# Altium schematic sheet Option_AP6xxx.SchDoc
size 297 x 209 mm
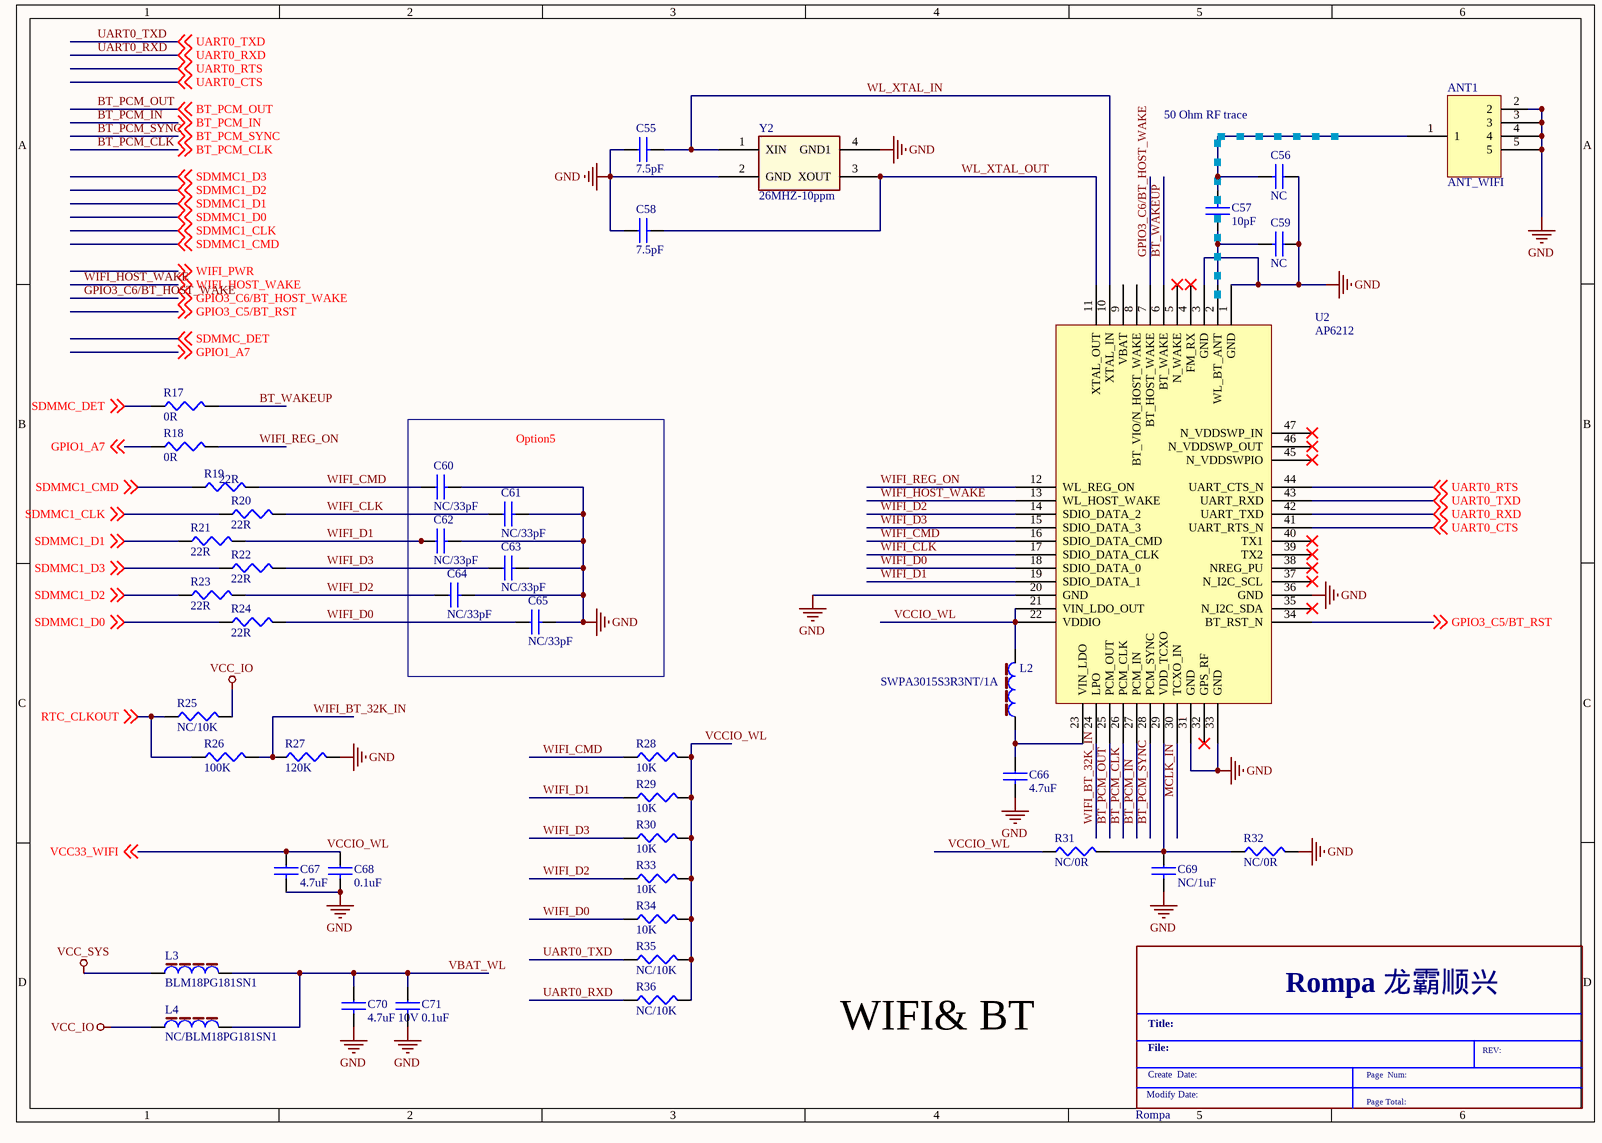
[diagram p0: Option_AP6xxx.SchDoc]

## Parts
*  Rompa  (graphical)
ANT1  ANT_WIFI
C55  7.5pF  [C0402]
C56  NC  [C0402]
C57  10pF  [C0402]
C58  7.5pF  [C0402]
C59  NC  [C0402]
C60  NC/33pF  [C0402]
C61  NC/33pF  [C0402]
C62  NC/33pF  [C0402]
C63  NC/33pF  [C0402]
C64  NC/33pF  [C0402]
C65  NC/33pF  [C0402]
C66  4.7uF  [C0603]
C67  4.7uF  [C0603]
C68  0.1uF  [C0402]
C69  NC/1uF  [C0402]
C70  4.7uF 10V  [C0603]
C71  0.1uF  [C0402]
L2  SWPA3015S3R3NT/1A
L3  BLM18PG181SN1  [L0603]
L4  NC/BLM18PG181SN1  [L0603]
R17  0R  [R0402]
R18  0R  [R0402]
R19  22R  [R0402]
R20  22R  [R0402]
R21  22R  [R0402]
R22  22R  [R0402]
R23  22R  [R0402]
R24  22R  [R0402]
R25  NC/10K  [R0402]
R26  100K  [R0402]
R27  120K  [R0402]
R28  10K  [R0402]
R29  10K  [R0402]
R30  10K  [R0402]
R31  NC/0R  [R0402]
R32  NC/0R  [R0402]
R33  10K  [R0402]
R34  10K  [R0402]
R35  NC/10K  [R0402]
R36  NC/10K  [R0402]
U2  AP6212
Y2  26MHZ-10ppm  [CRY-3225]

## Blocks framed on the sheet
Option5: C60-C65

## Nets
GND: ANT1.2 ANT1.3 ANT1.4 ANT1.5 C55.1 C56.1 C58.1 C59.1 C60.2 C61.2 C62.2 C63.2 C64.2 C65.2 C66.2 C67.2 C68.2 C69.2 C70.2 C71.2 R27.2 R32.2 U2.1(GND) U2.3(GND) U2.20(GND) U2.31(GND) U2.33(GND) U2.36(GND) Y2.2(GND) Y2.4(GND1)
VCC_IO: L4.1 R25.2
VCC_SYS: L3.1
BT_PCM_CLK: U2.26(PCM_CLK) ; off-sheet BT_PCM_CLK
BT_PCM_IN: U2.27(PCM_IN) ; off-sheet BT_PCM_IN
BT_PCM_OUT: U2.25(PCM_OUT) ; off-sheet BT_PCM_OUT
BT_PCM_SYNC: U2.28(PCM_SYNC) ; off-sheet BT_PCM_SYNC
BT_WAKEUP: R17.2 U2.6(BT_WAKE)
GPIO1_A7: R18.1 ; off-sheet GPIO1_A7
GPIO3_C5/BT_RST: U2.34(BT_RST_N) ; off-sheet GPIO3_C5/BT_RST
GPIO3_C6/BT_HOST_WAKE: U2.7(BT_HOST_WAKE) ; off-sheet GPIO3_C6/BT_HOST_WAKE
MCLK_IN: U2.30(TCXO_IN)
RTC_CLKOUT: R25.1 R26.1 ; off-sheet RTC_CLKOUT
SDMMC1_CLK: R20.1 ; off-sheet SDMMC1_CLK
SDMMC1_CMD: R19.1 ; off-sheet SDMMC1_CMD
SDMMC1_D0: R24.1 ; off-sheet SDMMC1_D0
SDMMC1_D1: R21.1 ; off-sheet SDMMC1_D1
SDMMC1_D2: R23.1 ; off-sheet SDMMC1_D2
SDMMC1_D3: R22.1 ; off-sheet SDMMC1_D3
SDMMC_DET: R17.1 ; off-sheet SDMMC_DET
UART0_CTS: U2.41(UART_RTS_N) ; off-sheet UART0_CTS
UART0_RTS: U2.44(UART_CTS_N) ; off-sheet UART0_RTS
UART0_RXD: R36.1 U2.42(UART_TXD) ; off-sheet UART0_RXD
UART0_TXD: R35.1 U2.43(UART_RXD) ; off-sheet UART0_TXD
VBAT_WL: C70.1 C71.1 L3.2 L4.2
VCCIO_WL: C67.1 C68.1 L2.2 R28.2 R29.2 R30.2 R31.1 R33.2 R34.2 R35.2 R36.2 U2.21(VIN_LDO_OUT) U2.22(VDDIO) ; off-sheet VCC33_WIFI  [also labelled VCC33_WIFI]
WIFI_BT_32K_IN: R26.2 R27.1 U2.24(LPO)
WIFI_CLK: C61.1 R20.2 U2.17(SDIO_DATA_CLK)
WIFI_CMD: C60.1 R19.2 R28.1 U2.16(SDIO_DATA_CMD)
WIFI_D0: C65.1 R24.2 R34.1 U2.18(SDIO_DATA_0)
WIFI_D1: C62.1 R21.2 R29.1 U2.19(SDIO_DATA_1)
WIFI_D2: C64.1 R23.2 R33.1 U2.14(SDIO_DATA_2)
WIFI_D3: C63.1 R22.2 R30.1 U2.15(SDIO_DATA_3)
WIFI_HOST_WAKE: U2.13(WL_HOST_WAKE) ; off-sheet WIFI_HOST_WAKE
WIFI_REG_ON: R18.2 U2.12(WL_REG_ON)
WL_XTAL_IN: C55.2 U2.10(XTAL_IN) Y2.1(XIN)
WL_XTAL_OUT: C58.2 U2.11(XTAL_OUT) Y2.3(XOUT)
NetANT1_1: ANT1.1 C56.2 C57.2
NetC57_1: C57.1 C59.2 U2.2(WL_BT_ANT)
NetC66_1: C66.1 L2.1 U2.23(VIN_LDO)
NetC69_1: C69.1 R31.2 R32.1 U2.29(VDD_TCXO)

Not connected (* = marked no-connect by the designer): U2 4(FM_RX)* 5(N_WAKE)* 8(BT_VIO/N_HOST_WAKE) 9(VBAT) 32(GPS_RF)* 35(N_I2C_SDA)* 37(N_I2C_SCL)* 38(NREG_PU)* 39(TX2)* 40(TX1)* 45(N_VDDSWPIO)* 46(N_VDDSWP_OUT)* 47(N_VDDSWP_IN)*

## Notes on the sheet
- 50 Ohm RF trace
- WIFI& BT
- (in symbol Rompa) Rompa 龙霸顺兴; Title:; File:; REV:; Create  Date:; Page  Num:; Modify Date:; Page Total:

## Library data of the parts
ANT1 = AP6xxx_ANT
C55-C65 C68 C69 C71 = CAP NP
C66 = CAP NP_Dup1: 10V
C67 = CAP NP_Dup1: 6.3V
C70 = CAP NP_Dup1
L2 = INDUCTOR_2: IND_3x3  3.3uH/1A
L3 L4 = INDUCTOR_2
R17-R36 = RESISTOR
U2 = AP6xxx
Y2 = CRYSTAL-4_0